# EAGLE design testShield (EAGLE 9.2.0)
CNAME: Arduino shield for basic programmingtraining; CREVISION: 1; DESIGNER: Jani Lehto
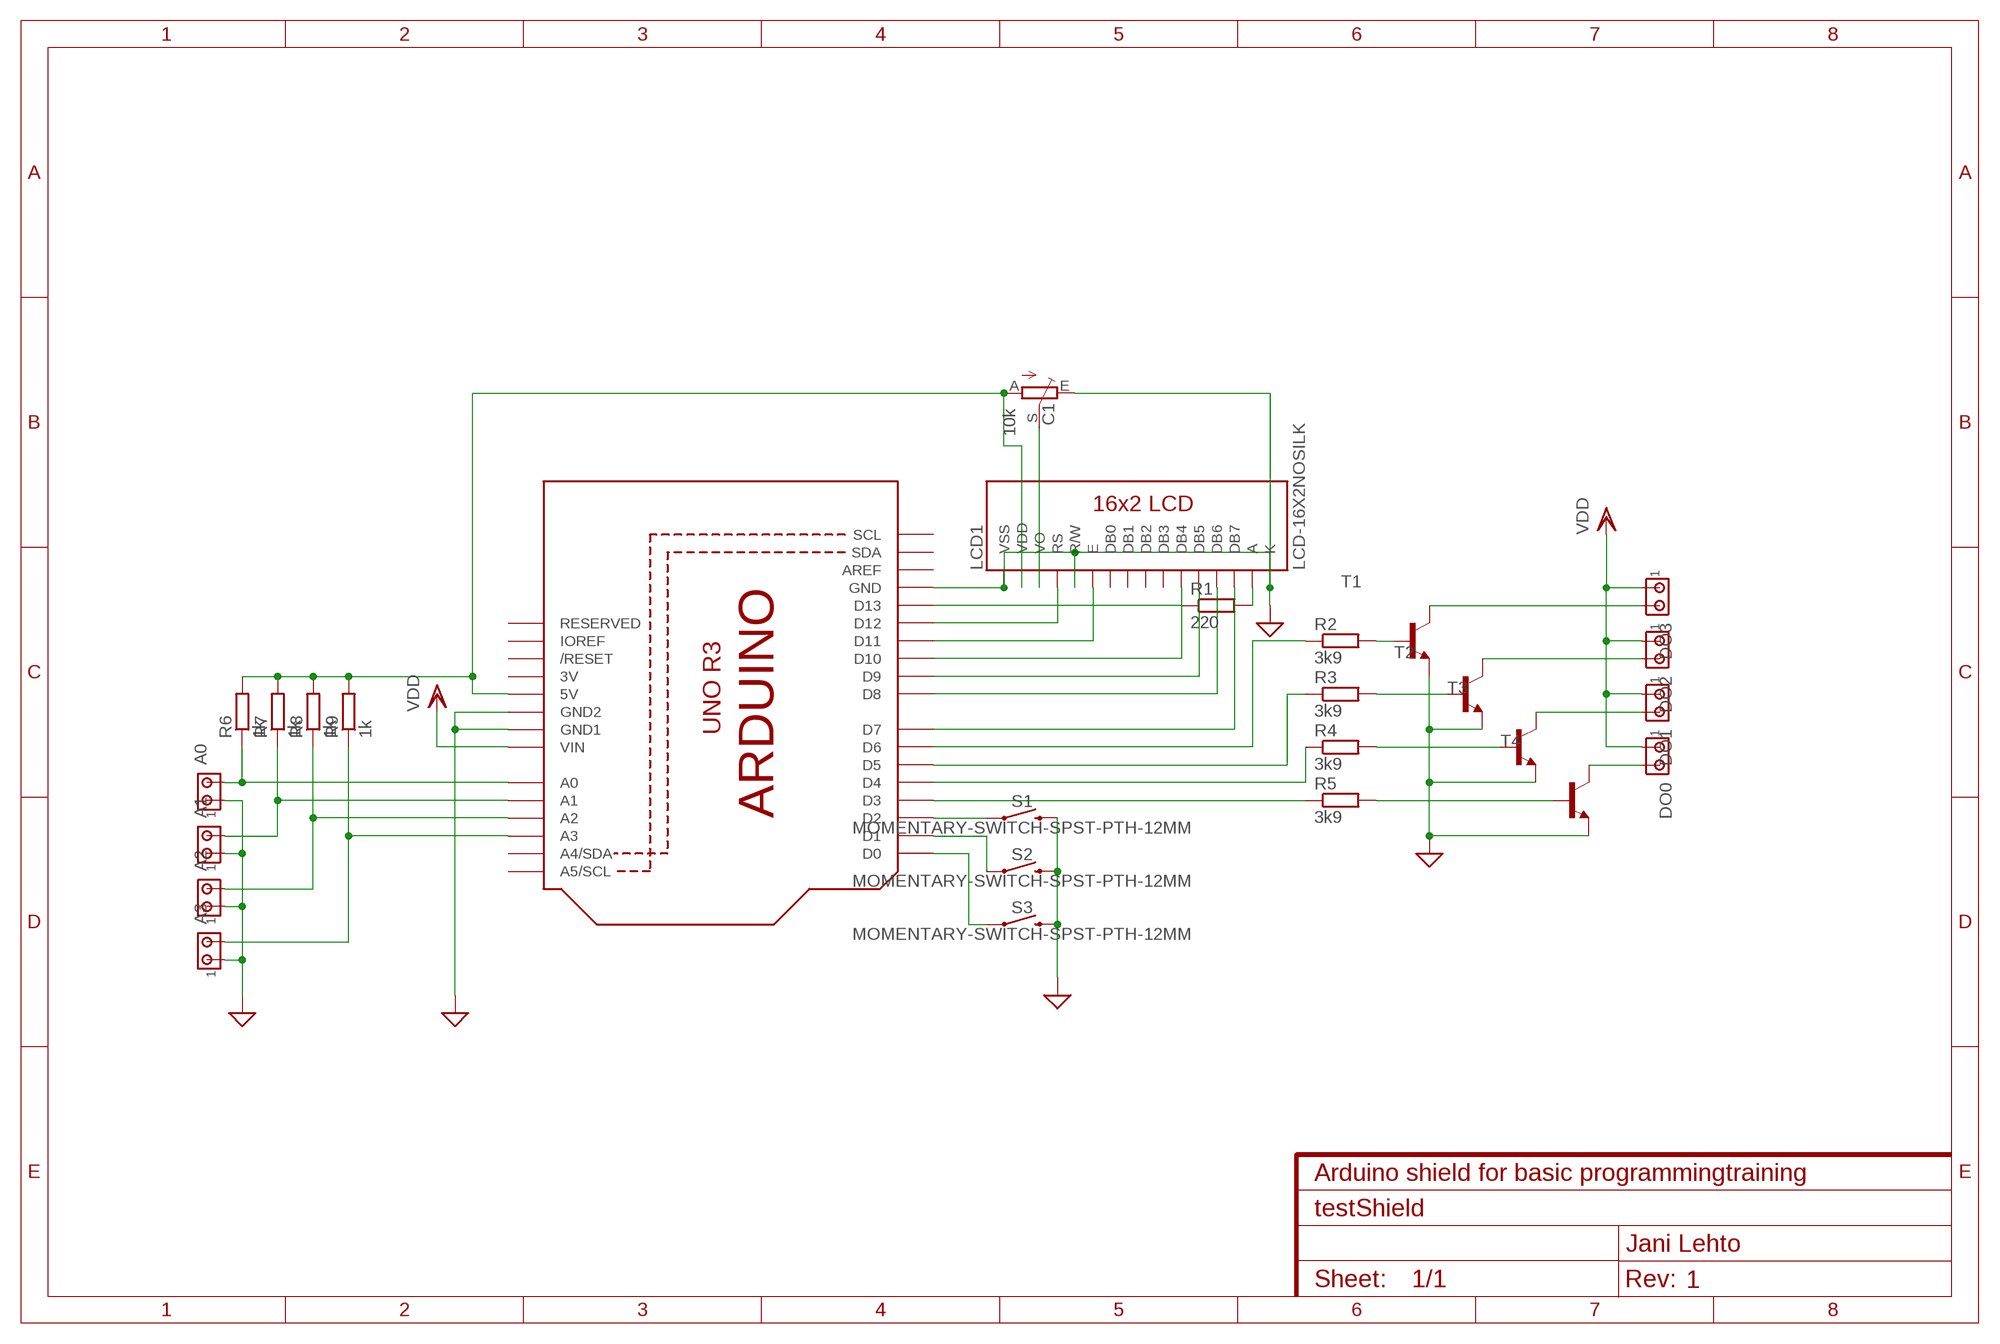
[diagram p0: schematic, sheet 1]

## Parts
A0  MTA02-156  [1X2MTA]
A1  MTA02-156  [1X2MTA]
A2  MTA02-156  [1X2MTA]
A3  MTA02-156  [1X2MTA]
C1  10k  TRIM_EU-CA9V  [CA9V]
DO0  MTA02-156  [1X2MTA]
DO1  MTA02-156  [1X2MTA]
DO2  MTA02-156  [1X2MTA]
DO3  MTA02-156  [1X2MTA]
LCD1  LCD-16X2NOSILK  [LCD-16X2_NOSILK]
R1  220  R-EU_0617/22  [0617/22]
R2  3k9  R-EU_0207/12  [0207/12]
R3  3k9  R-EU_0207/12  [0207/12]
R4  3k9  R-EU_0207/12  [0207/12]
R5  3k9  R-EU_0207/12  [0207/12]
R6  1k  R-EU_0207/12  [0207/12]
R7  1k  R-EU_0207/12  [0207/12]
R8  1k  R-EU_0207/12  [0207/12]
R9  1k  R-EU_0207/12  [0207/12]
S1  MOMENTARY-SWITCH-SPST-PTH-12MM  [TACTILE_SWITCH_PTH_12MM]
S2  MOMENTARY-SWITCH-SPST-PTH-12MM  [TACTILE_SWITCH_PTH_12MM]
S3  MOMENTARY-SWITCH-SPST-PTH-12MM  [TACTILE_SWITCH_PTH_12MM]
T1  BC547-NPN-TO92-CBE  [TO92-CBE]
T2  BC547-NPN-TO92-CBE  [TO92-CBE]
T3  BC547-NPN-TO92-CBE  [TO92-CBE]
T4  BC547-NPN-TO92-CBE  [TO92-CBE]
U1  ARDUINOR3-BPLACE  [ARDUINOR3-BPLACE]

## Nets
GND: A0.1 A1.1 A2.1 A3.1 C1.E LCD1.1(VSS) LCD1.5(R/W) LCD1.16(K) S1.3 S2.3 S3.3 T1.E T2.E T3.E T4.E U1.GND U1.GND1 U1.GND2 ; supply symbol labelled SUP
N$1: R2.2 T1.B
N$3: LCD1.15(A) R1.2
N$4: R1.1 U1.D13
N$5: S1.1 U1.D2
N$6: C1.S LCD1.3(VO)
N$7: LCD1.4(RS) U1.D12
N$8: LCD1.6(E) U1.D11
N$9: LCD1.11(DB4) U1.D10
N$10: LCD1.12(DB5) U1.D9
N$11: LCD1.13(DB6) U1.D8
N$12: LCD1.14(DB7) U1.D7
N$13: S2.1 U1.D1
N$14: S3.1 U1.D0
N$15: R2.1 U1.D6
N$16: R3.1 U1.D5
N$17: R4.1 U1.D4
N$18: R5.1 U1.D3
N$19: R5.2 T4.B
N$20: R4.2 T3.B
N$21: R3.2 T2.B
N$22: DO3.2 T1.C
N$23: DO2.2 T2.C
N$24: DO1.2 T3.C
N$25: DO0.2 T4.C
N$26: A0.2 R6.1 U1.A0
N$27: A1.2 R7.1 U1.A1
N$28: A2.2 R8.1 U1.A2
N$29: A3.2 R9.1 U1.A3
N$30: C1.A LCD1.2(VDD) R6.2 R7.2 R8.2 R9.2 U1.5V
VDD: DO0.1 DO1.1 DO2.1 DO3.1 U1.VIN
Unconnected: LCD1.7(DB0) LCD1.8(DB1) LCD1.9(DB2) LCD1.10(DB3) U1.A4(A4/SDA) U1.A5(A5/SCL) U1.AREF U1.IOREF U1.RESERVED U1.RESET(/RESET) U1.SCL U1.SDA

## Power pins joined to a net without a drawn wire
3V: U1.3V

## Library data of the parts
A0 A1-A3 DO0 DO1-DO3 = con-amp:MTA02-156: AMP connector
C1 = pot:TRIM_EU-: POTENTIOMETER
LCD1 = SparkFun-Displays:LCD-16X2: Standard text-only 16x2 parallel input LCD Basic 16 character by 2 line display. Typically utilizes the extremely common HD44780 parallel interface chipset SparkFun Products: Basic 16x2 Green <https://www.sparkfun.com/products/255> Basic 8x2 Green <https://www.sparkfun.com/products/11122>; SF_ID: LCD-00255
R1-R9 = rcl:R-EU_: RESISTOR, European symbol; SPICEPREFIX: R
S1-S3 = SparkFun-Switches:MOMENTARY-SWITCH-SPST: Momentary Switch (Pushbutton) - SPST Normally-open (NO) SPST momentary switches (buttons, pushbuttons). Variants PTH-12MM - 12mm square, through-hole Momentary Pushbutton Switch - 12mm Square <https://www.sparkfun.com/products/9190> (COM-09190) PTH-6.0MM, PTH-6.0MM-KIT - 6.0mm square, through-hole Mini Pushbutton Switch <https://www.sparkfun.com/products/97> (COM-00097) KIT package intended for soldering kit's - only one side of pads' copper is exposed. PTH-RIGHT-ANGLE-KIT - Right-angle, through-hole Right Angle Tactile Button <https://www.sparkfun.com/products/10791> - Used on SparkFun BigTime Watch Kit <https://www.sparkfun.com/products/11734> SMD-12MM - 12mm square, surface-mount Tactile Button - SMD (12mm) <https://www.sparkfun.com/products/12993> (COM-12993) Used on SparkFun PicoBoard <https://www.sparkfun.com/products/11888> SMD-4.5MM - 4.5mm Square Trackball Switch Used on SparkFun Blackberry Trackballer Breakout <https://www.sparkfun.com/products/13169> SMD-4.6MMX2.8MM - 4.60mm x 2.80mm, surface mount Used on SparkFun SAMD21 Mini Breakout <https://www.sparkfun.com/products/13664> SMD-5.2MM, SMD-5.2-REDUNDANT - 5.2mm square, surface-mount Mini Pushbutton Switch - SMD <https://www.sparkfun.com/products/8720> (COM-08720) Used on Arduino Pro Mini <https://www.sparkfun.com/products/11114> REDUNDANT package connects both switch circuits together SMD-6.0X3.5MM - 6.0 x 3.5mm, surface mount Momentary Reset Switch SMD <https://www.sparkfun.com/products/8229> (COM-08229) SMD-6.2MM-TALL - 6.2mm square, surface mount Tactile Button - SMD (6mm) <https://www.sparkfun.com/products/12992> Used on SparkFun Digital Sandbox <https://www.sparkfun.com/products/12651> SMD-RIGHT-ANGLE - Right-angle, surface mount Used on SparkFun Block for Intel® Edison - Arduino <https://www.sparkfun.com/products/13036>; PROD_ID: SWCH-09185; SF_SKU: COM-09190
T1-T4 = DC_LOAD_AU:*-NPN-: NPN Transistror BF959 corrected 2008.03.06
U1 = adafruit:ARDUINOR3: This is a new object for the new Arduino R3 - with extra pins that you may want to use (such as IOref, and duplicated A4/A5

## Net classes
0 default: width 1.27 mm, drill 0.8 mm, clearance 0.508 mm

## Board
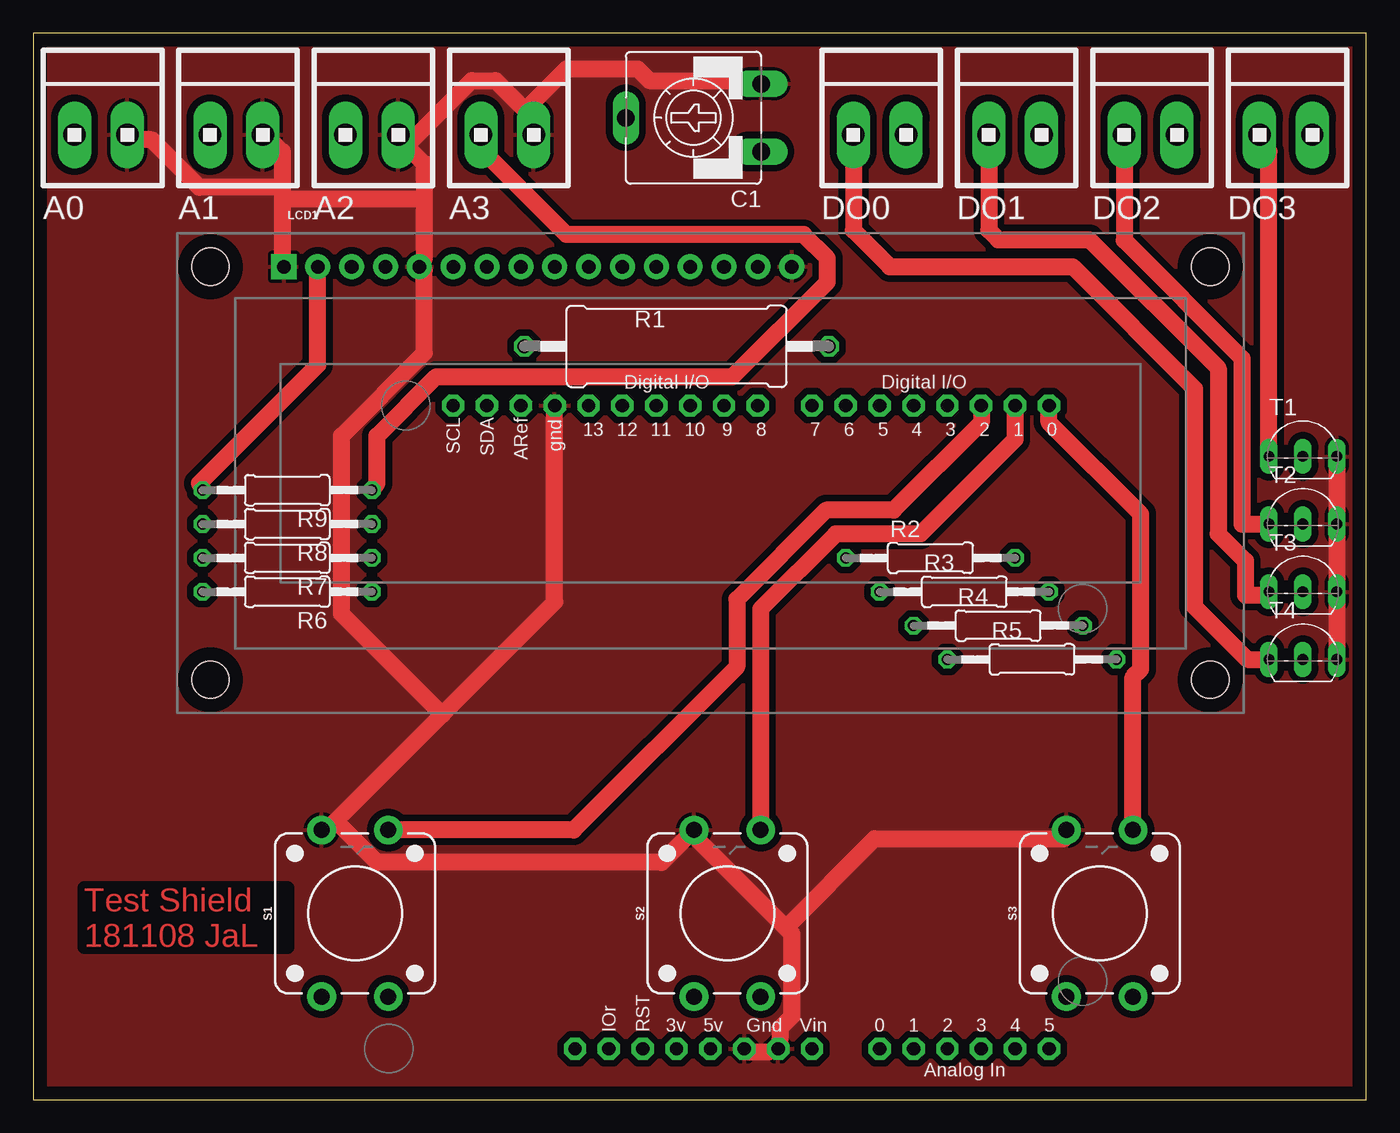
[diagram p1: board, top side]
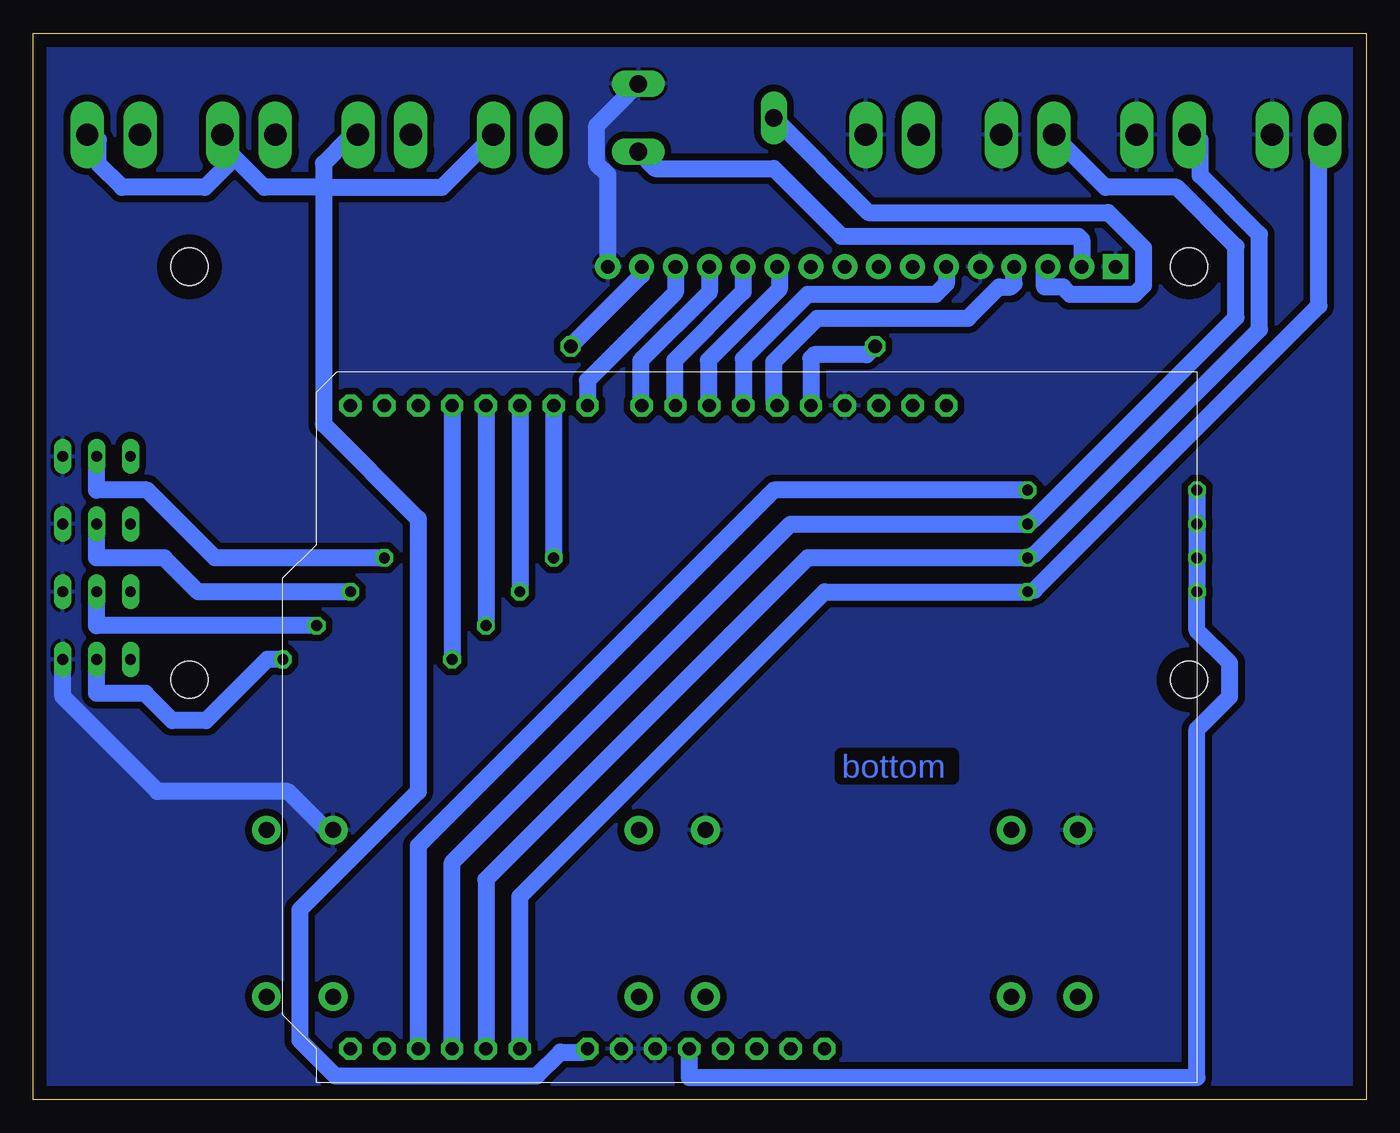
[diagram p2: board, bottom side, seen from below]

Size 100 x 80 mm. Coordinates in mm from the lower left corner, seen from the top.
Outline: 0,0 100,0 100,80 0,80 0,0
Copper layers (1*16): Top 0.035mm / dielectric 1.5mm / Bottom 0.035mm
Design rules "default": minimum track width 6mil, minimum drill 0.35mm, track to track 6mil, track to pad 6mil, pad to pad 6mil, via to via 6mil, smd to smd 6mil, copper to edge 40mil, drill to drill 6mil, minimum pad ring 10mil, minimum via ring 8mil, stop-mask expansion 4mil, vias tented up to drill 0mil, thermal gap 10mil

### Footprints (pad centres in the part's own frame; a part is rotated, then mirrored left to right if it is on the bottom)
1X2MTA = drill 1.676 long: 1 1.981,0; 2 -1.981,0
CA9V = drill 1.321 long: A -2.54,-5.08; E 2.54,-5.08; S 0,5.08
LCD-16X2_NOSILK = drill 1.016 pad 1.88 square: 1 -32,15.5 | drill 1.016 pad 1.88: 2 -29.46,15.5; 3 -26.92,15.5; 4 -24.38,15.5; 5 -21.84,15.5; 6 -19.3,15.5; 7 -16.76,15.5; 8 -14.22,15.5; 9 -11.68,15.5; 10 -9.14,15.5; 11 -6.6,15.5; 12 -4.06,15.5; 13 -1.52,15.5; 14 1.02,15.5; 15 3.56,15.5; 16 6.1,15.5 | hole 2.8: -37.5,15.5; -37.5,-15.5; 37.5,15.5; 37.5,-15.5
0617/22 = drill 1.016 octagon: 1 -11.43,0; 2 11.43,0
0207/12 = drill 0.813 octagon: 1 -6.35,0; 2 6.35,0
TACTILE_SWITCH_PTH_12MM = drill 1.2 pad 2.159: 1 6.25,-2.5; 2 -6.25,-2.5; 3 6.25,2.5; 4 -6.25,2.5
TO92-CBE = drill 0.813 long: B 0,0; C -2.54,0; E 2.54,0
ARDUINOR3-BPLACE = drill 1 pad 1.676 octagon: 3V 35.56,2.54; 5V 38.1,2.54; A0 50.8,2.54; A1 53.34,2.54; A2 55.88,2.54; A3 58.42,2.54; A4 60.96,2.54; A5 63.5,2.54; AREF 23.876,50.8; D0 63.5,50.8; D1 60.96,50.8; D2 58.42,50.8; D3 55.88,50.8; D4 53.34,50.8; D5 50.8,50.8; D6 48.26,50.8; D7 45.72,50.8; D8 41.656,50.8; D9 39.116,50.8; D10 36.576,50.8; D11 34.036,50.8; D12 31.496,50.8; D13 28.956,50.8; GND 26.416,50.8; GND1 43.18,2.54; GND2 40.64,2.54; IOREF 30.48,2.54; RESERVED 27.94,2.54; RESET 33.02,2.54; SCL 18.796,50.8; SDA 21.336,50.8; VIN 45.72,2.54

### Placement (x,y rotation side)
A0  5.08,72.39 0 top
A1  15.24,72.39 0 top
A2  25.4,72.39 0 top
A3  35.56,72.39 0 top
C1  49.53,73.66 90 top
DO0  63.5,72.39 0 top
DO1  73.66,72.39 0 top
DO2  83.82,72.39 0 top
DO3  93.98,72.39 0 top
LCD1  50.8,46.99 0 top
R1  48.26,56.52 0 top
R2  67.31,40.64 0 top
R3  69.85,38.1 0 top
R4  72.39,35.56 0 top
R5  74.93,33.02 0 top
R6  19.05,38.1 180 top
R7  19.05,40.64 180 top
R8  19.05,43.18 180 top
R9  19.05,45.72 180 top
S1  24.13,13.97 90 top
S2  52.07,13.97 90 top
S3  80.01,13.97 90 top
T1  95.25,48.26 0 top
T2  95.25,43.18 0 top
T3  95.25,38.1 0 top
T4  95.25,33.02 0 top
U1  12.7,1.27 0 top

### Tracks (layer width: path | path; a pad name or v marks a point on that pad's centre or on a via)
GND
  Top 1.27: 18.67,68.45 18.67,71.12 17.78,72.01 A1.1 | 18.67,68.45 18.67,67.56 | 18.67,67.56 18.67,63.12 LCD1.1 | 18.67,68.45 12.45,68.45 8.89,72.01 7.11,72.01 A0.1 | 29.34,67.56 29.34,70.23 27.56,72.01 A2.1 28.45,72.01 32.89,76.45 34.67,76.45 37.34,73.79 37.34,72.9 A3.1 37.34,74.68 40.01,77.34 45.34,77.34 46.23,76.45 54.23,76.45 C1.E | 29.34,67.56 29.34,63.12 LCD1.5 29.34,62.23 29.34,56.01 23.11,49.78 23.11,36.45 30.67,28.89 | 29.34,67.56 18.67,67.56 | U1.GND 39.12,37.34 30.67,28.89 | 22.67,20.89 22.23,20.45 S1.3 | 22.67,20.89 30.67,28.89 | T4.E T3.E T2.E T1.E | U1.GND2 53.34,3.56 55.12,3.56 U1.GND1 56.01,4.45 56.01,5.33 56.9,6.22 56.9,12.45 56.45,12.89 | 56.45,12.89 49.78,19.56 S2.3 48.9,19.56 47.12,17.78 25.78,17.78 22.67,20.89 | 56.45,12.89 63.12,19.56 77.34,19.56 S3.3
  Bottom 1.27: LCD1.16 56.9,69.4 57.73,70.24 57.73,73.08 C1.E | T4.E 97.79,30.23 90.68,23.11 80.9,23.11 78.23,20.45 S3.3
  pour Bottom: 0,0 0,80.01 100.33,80.01 100.33,0
  pour Top: 0,0 0,80.01 100.33,80.01 100.33,0
N$1
  Bottom 1.27: R2.2 86.36,40.64 91.44,45.72 95.25,45.72 T1.B
N$3
  Bottom 1.27: LCD1.15 54.36,61.84 R1.2
N$4
  Bottom 1.27: R1.1 37.47,55.88 41.41,55.88 41.66,55.63 U1.D13
N$5
  Top 1.27: U1.D2 71.12,50.8 64.54,44.22 59.48,44.22 52.79,37.54 52.79,32.47 40.54,20.22 S1.1
N$6
  Bottom 1.27: C1.S 37.34,66.55 19.36,66.55 16.72,63.9 16.72,61.08 17.39,60.41 22.2,60.41 22.76,60.96 24.13,60.96 24.13,62.24 LCD1.3
N$7
  Bottom 1.27: U1.D12 44.45,52.32 44.45,55.35 41.17,58.63 29.88,58.63 27.54,60.96 26.67,60.96 26.42,61.21 LCD1.4
N$8
  Bottom 1.27: LCD1.6 31.5,61.21 32.3,60.41 41.91,60.41 46.74,55.58 U1.D11
N$9
  Bottom 1.27: LCD1.11 44.02,62.31 44.02,60.81 49.35,55.48 49.35,52.15 U1.D10
N$10
  Bottom 1.27: LCD1.12 46.74,60.61 51.89,55.45 51.89,52.15 U1.D9
N$11
  Bottom 1.27: LCD1.13 49.28,60.58 54.43,55.43 54.43,52.15 U1.D8
N$12
  Bottom 1.27: LCD1.14 51.82,60.55 58.42,53.95 U1.D7
N$13
  Top 1.27: U1.D1 73.66,49.53 66.57,42.44 60.21,42.44 54.57,36.8 S2.1
N$14
  Top 1.27: S3.1 82.51,31.7 83.08,32.27 83.08,43.92 76.2,50.8 U1.D0
N$15
  Bottom 1.27: U1.D6 R2.1
N$16
  Bottom 1.27: U1.D5 R3.1
N$17
  Bottom 1.27: U1.D4 R4.1
N$18
  Bottom 1.27: U1.D3 R5.1
N$19
  Bottom 1.27: R5.2 82.45,33.02 87.04,28.44 89.56,28.44 91.61,30.48 95.25,30.48 T4.B
N$20
  Bottom 1.27: R4.2 95.25,35.56 T3.B
N$21
  Bottom 1.27: R3.2 87.63,38.1 90.17,40.64 95.25,40.64 T2.B
N$22
  Top 1.27: DO3.2 91.44,72.39 92.71,71.12 T1.C
N$23
  Top 1.27: DO2.2 81.84,64.47 90.68,55.63 90.68,43.18 T2.C
N$24
  Top 1.27: DO1.2 71.68,65.23 72.39,64.52 79.25,64.52 88.9,54.86 88.9,42.44 90.93,40.41 90.93,37.85 92.46,37.85 T3.C
N$25
  Top 1.27: DO0.2 61.52,65.23 64.26,62.48 77.98,62.48 87.12,53.34 87.12,36.98 91.08,33.02 T4.C
N$26
  Bottom 1.27: U1.A0 63.5,15.24 40.64,38.1 R6.1 24.89,38.23 3.56,59.56 3.56,72.01 A0.2
N$27
  Bottom 1.27: U1.A1 66.04,16.51 41.91,40.64 R7.1 24.89,40.89 8,57.78 8,64.9 12.45,69.34 12.45,72.01 A1.2
N$28
  Bottom 1.27: U1.A2 68.58,17.78 43.18,43.18 R8.1 24.89,43.56 9.78,58.67 9.78,64.01 14.22,68.45 19.56,68.45 23.11,72.01 A2.2
N$29
  Top 1.27: A3.2 33.78,72.01 33.78,71.12 40.01,64.9 57.78,64.9 59.56,63.12 59.56,61.34 52.45,54.23 30.23,54.23 25.78,49.78 25.78,46.23 R9.1
  Bottom 1.27: R9.1 44.45,45.72 71.12,19.05 U1.A3
N$30
  Top 1.27: LCD1.2 21.34,62.23 21.34,55.12 12.45,46.23 R9.2
  Bottom 1.27: U1.5V 50.8,1.65 12.7,1.65 12.7,27.77 10.25,30.23 10.25,32.75 12.7,35.2 R6.2 R7.2 R8.2 R9.2 | C1.A 53.34,69.85 44.45,69.85 39.37,64.77 21.59,64.77 21.34,64.52 LCD1.2
VDD
  Bottom 1.27: 78.23,68.45 78.23,70.23 76.45,72.01 DO1.1 | 78.23,68.45 78.23,50.67 71.12,43.56 71.12,23.11 80.01,14.22 80.01,4.45 77.34,1.78 62.23,1.78 60.45,3.56 58.67,3.56 U1.VIN | 78.23,68.45 69.34,68.45 65.79,72.01 DO0.1 | 78.23,68.45 82.68,68.45 85.34,71.12 85.34,72.01 DO2.1 85.34,70.23 87.12,68.45 93.34,68.45 95.12,70.23 95.12,72.01 DO3.1

### Text on the board
Top: Test Shield / 181108 JaL
Bottom: bottom